# Altium schematic sheet Connectors.SchDoc
size A; SheetNumber: 1; SheetTotal: 5
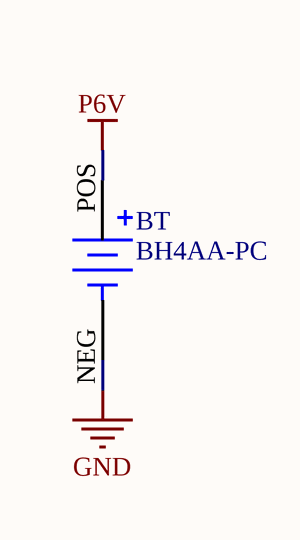
[diagram p0: Connectors.SchDoc]

## Parts
BT  BH4AA-PC  [BAT_BH4AA-PC]

## Nets
GND: BT.NEG
P6V: BT.POS

## Library data of the parts
BT = BH4AA-PC: Battery Holder _Open_ AA 4 Cell PC Pin; MP: BH4AAPC; MF: MPD; Availability: Unavailable; SnapEDA_Link: https://www.snapeda.com/parts/BH4AAPC/MPD/view-part/112528/?ref=snap; Price: None; Package: None; Value: *